# EAGLE design breakout (EAGLE 6.5.0)
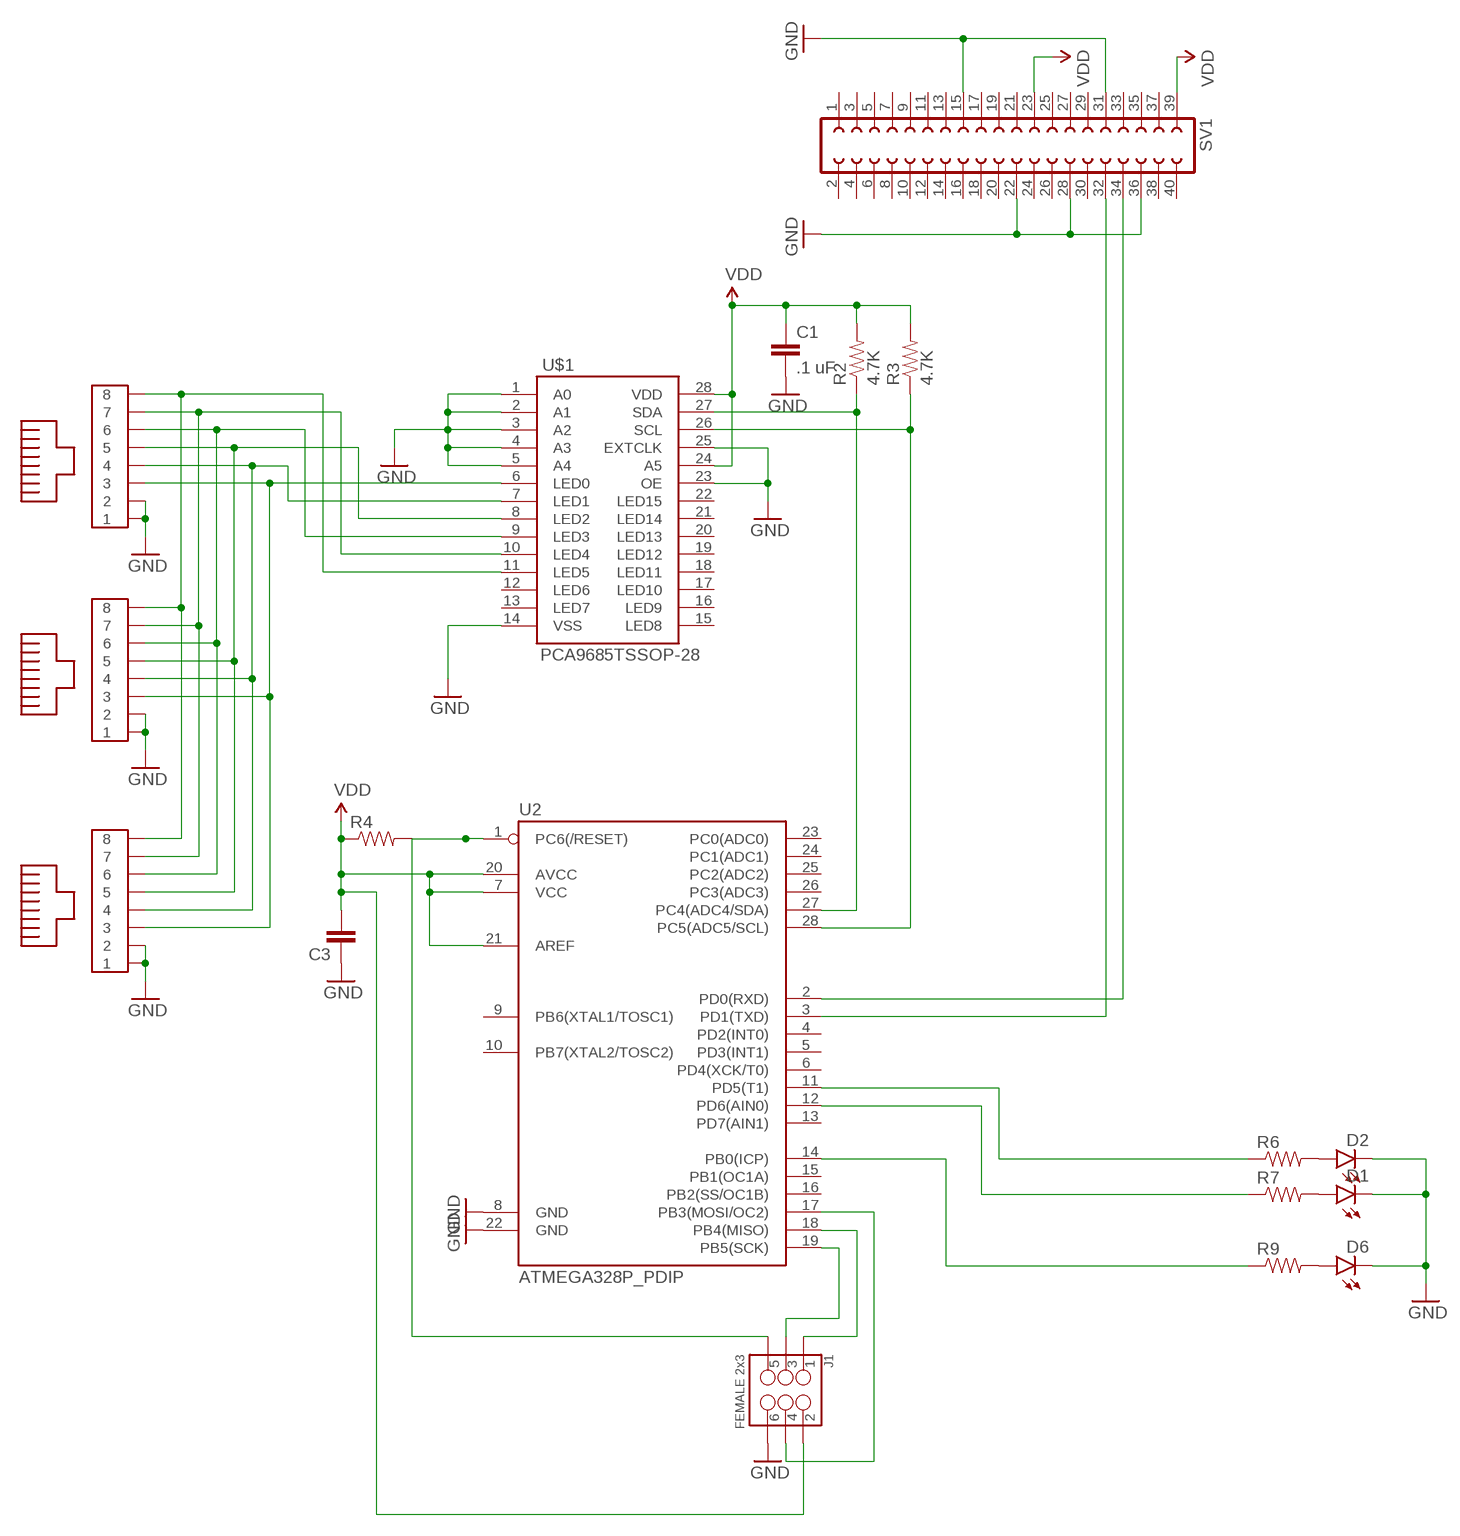
[diagram p0: schematic, sheet 1]

## Parts
C1  .1 uF  CAP1206  [1206]
C3  CAP1206  [1206]
D1  LED0603  [LED-0603]
D2  LED0603  [LED-0603]
D6  LED0603  [LED-0603]
J1  FEMALE 2x3  M03X2FEMALE  [2X3]
R2  4.7K  RESISTOR1206  [1206]
R3  4.7K  RESISTOR1206  [1206]
R4  RESISTOR1206  [1206]
R6  RESISTOR1206  [1206]
R7  RESISTOR1206  [1206]
R9  RESISTOR1206  [1206]
SV1  FE20-2  [FE20-2]
U2  ATMEGA328P_PDIP  [DIL28-3]
U$1  PCA9685TSSOP-28  [TSSOP28]
U$2  MOLEX-RJ45-SMT  [MOLEX-RJ45-SMT]
U$3  MOLEX-RJ45-SMT  [MOLEX-RJ45-SMT]
U$4  MOLEX-RJ45-SMT  [MOLEX-RJ45-SMT]

## Nets
GND: C1.2 C3.1 D1.C D2.C D6.C J1.6 SV1.15 SV1.22 SV1.28 SV1.31 SV1.36 U2.8(GND) U2.22(GND) U$1.1(A0) U$1.2(A1) U$1.3(A2) U$1.4(A3) U$1.5(A4) U$1.14(VSS) U$1.23(OE) U$1.25(EXTCLK) U$2.1 U$2.2 U$3.1 U$3.2 U$4.1 U$4.2
N$1: SV1.32 U2.3(PD1(TXD))
N$2: J1.5 R4.2 U2.1(PC6(/RESET))
N$3: U$1.6(LED0) U$2.3 U$3.3 U$4.3
N$4: R2.1 U2.27(PC4(ADC4/SDA)) U$1.27(SDA)
N$7: D2.A R6.2
N$8: J1.4 U2.17(PB3(MOSI/OC2))
N$10: SV1.34 U2.2(PD0(RXD))
N$11: U$1.7(LED1) U$2.4 U$3.4 U$4.4
N$12: U$1.11(LED5) U$2.8 U$3.8 U$4.8
N$13: U$1.10(LED4) U$2.7 U$3.7 U$4.7
N$14: U$1.9(LED3) U$2.6 U$3.6 U$4.6
N$15: U$1.8(LED2) U$2.5 U$3.5 U$4.5
N$16: J1.1 U2.18(PB4(MISO))
N$17: J1.3 U2.19(PB5(SCK))
N$18: D1.A R7.2
N$20: D6.A R9.2
N$21: R9.1 U2.14(PB0(ICP))
N$23: R7.1 U2.12(PD6(AIN0))
N$24: R6.1 U2.11(PD5(T1))
N$25: R3.1 U2.28(PC5(ADC5/SCL)) U$1.26(SCL)
VDD: C1.1 C3.2 J1.2 R2.2 R3.2 R4.1 SV1.23 SV1.39 U2.7(VCC) U2.20(AVCC) U2.21(AREF) U$1.24(A5) U$1.28(VDD)
Unconnected: SV1.1 SV1.2 SV1.3 SV1.4 SV1.5 SV1.6 SV1.7 SV1.8 SV1.9 SV1.10 SV1.11 SV1.12 SV1.13 SV1.14 SV1.16 SV1.17 SV1.18 SV1.19 SV1.20 SV1.21 SV1.24 SV1.25 SV1.26 SV1.27 SV1.29 SV1.30 SV1.33 SV1.35 SV1.37 SV1.38 SV1.40 U2.4(PD2(INT0)) U2.5(PD3(INT1)) U2.6(PD4(XCK/T0)) U2.9(PB6(XTAL1/TOSC1)) U2.10(PB7(XTAL2/TOSC2)) U2.13(PD7(AIN1)) U2.15(PB1(OC1A)) U2.16(PB2(SS/OC1B)) U2.23(PC0(ADC0)) U2.24(PC1(ADC1)) U2.25(PC2(ADC2)) U2.26(PC3(ADC3)) U$1.12(LED6) U$1.13(LED7) U$1.15(LED8) U$1.16(LED9) U$1.17(LED10) U$1.18(LED11) U$1.19(LED12) U$1.20(LED13) U$1.21(LED14) U$1.22(LED15)

## Library data of the parts
C1 C3 = SparkFun-Capacitors:CAP: Capacitor Standard 0603 ceramic capacitor, and 0.1" leaded capacitor.
D1 D2 D6 = SparkFun-LED:LED: LEDs Standard schematic elements and footprints for 5mm, 3mm, 1206, and 0603 sized LEDs. 5mm - Spark Fun Electronics SKU : COM-00529 (and others)
J1 = SparkFun-Connectors:M03X2: 2x3 .1" header. Shrouded, with keying- CONN-10681 SMT- CONN-11415 Pogo pins- HW-11044; PROD_ID: CONN-11566
R2-R4 R6 R7 R9 = SparkFun-Resistors:RESISTOR: Resistor Basic schematic elements and footprints for 0603, 1206, and PTH resistors.
SV1 = con-lsta:FE20-2: FEMALE HEADER; OC_FARNELL: unknown; OC_NEWARK: unknown
U2 = SparkFun-DigitalIC:ATMEGA328P_PDIP: uC used in the Arduino 32kb flash, 1k EEPROM, 2k SRAM This is the through-hole version of this chip.
U$1 = MyLibrary:PCA9685
U$2-U$4 = SMD-RJ45:MOLEX-RJ45-SMT

## Board
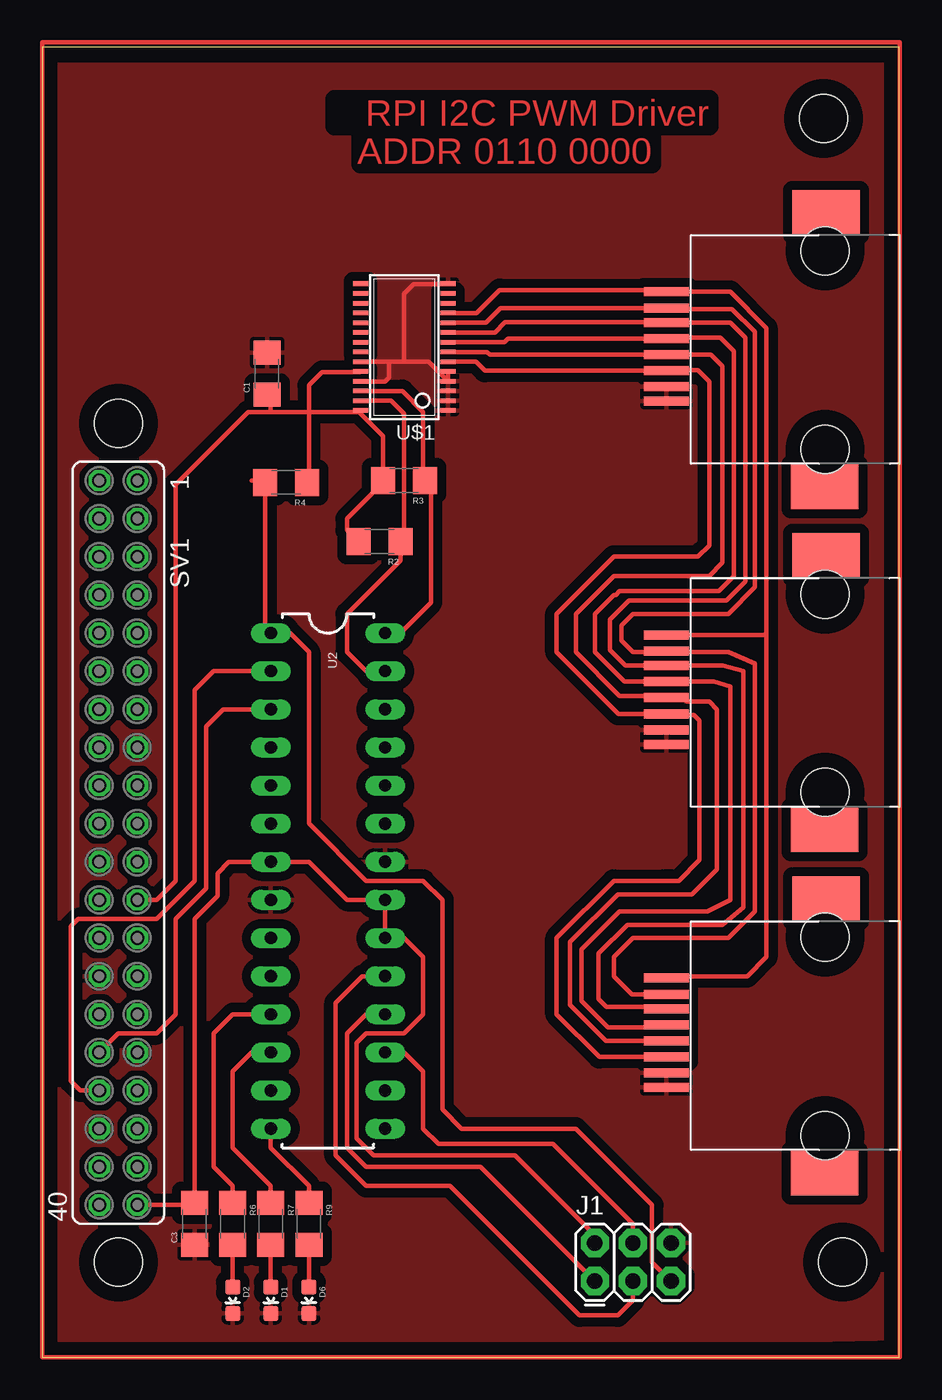
[diagram p1: board, top side]
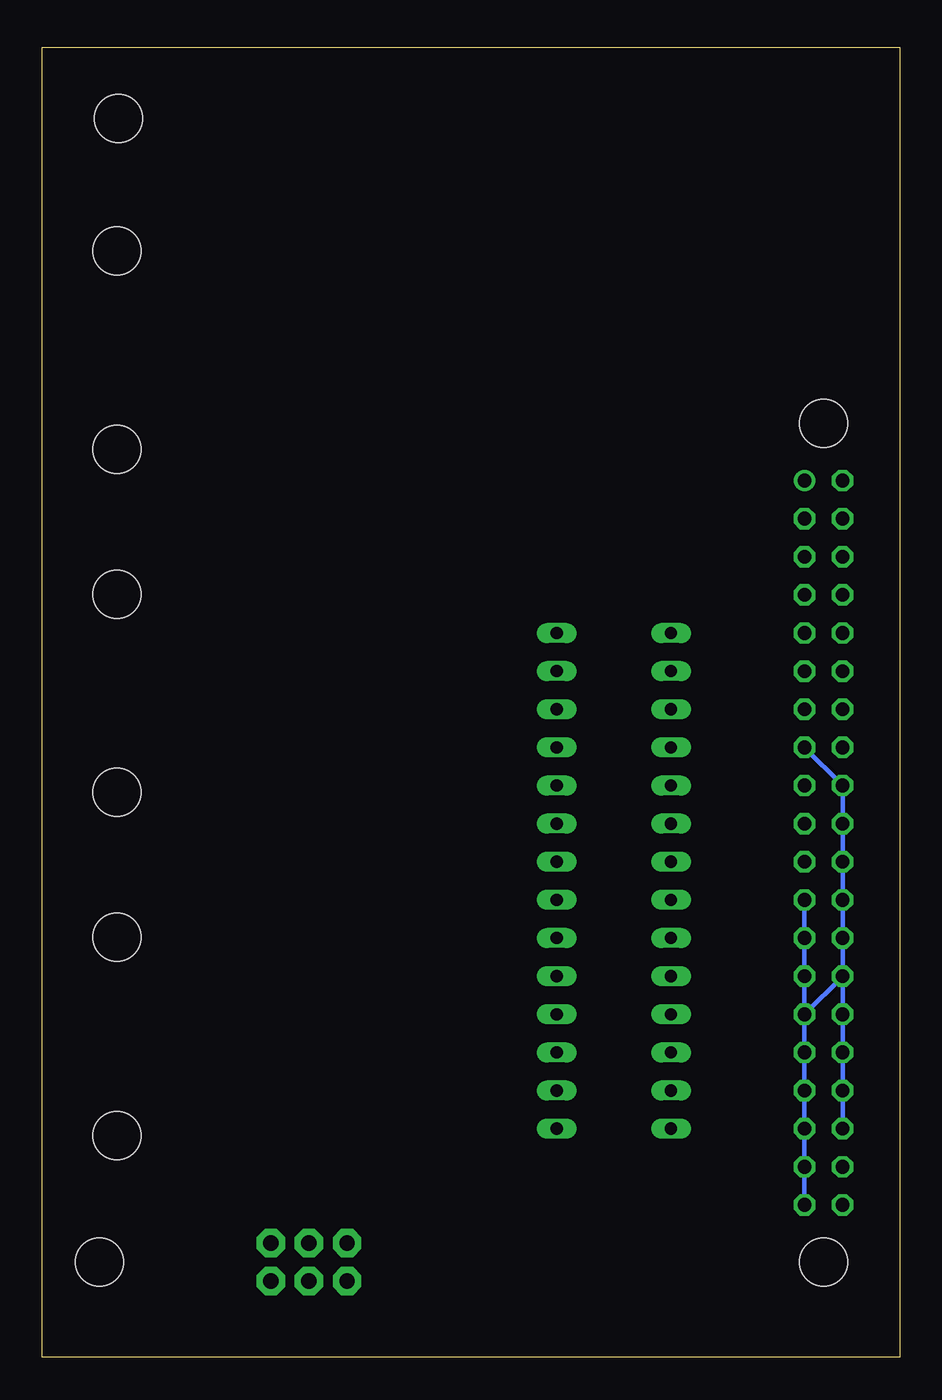
[diagram p2: board, bottom side, seen from below]

Size 57.13 x 87.3 mm. Coordinates in mm from the lower left corner, seen from the top.
Outline: 0,0 57.13,0 57.13,87.3 0,87.3 0,0
Copper layers (1*16): Top 0.035mm / dielectric 1.5mm / Bottom 0.035mm
Design rules "default": minimum track width 10mil, minimum drill 24mil, track to track 8mil, track to pad 8mil, pad to pad 8mil, via to via 8mil, smd to smd 8mil, copper to edge 40mil, drill to drill 8mil, minimum pad ring 10mil, minimum via ring 8mil, stop-mask expansion 4mil, vias tented up to drill 0mil, thermal gap 10mil
Holes 3.2 mm at 52.07,82.55 5.08,6.35 53.34,6.35 5.08,62.23

### Footprints (pad centres in the part's own frame; a part is rotated, then mirrored left to right if it is on the bottom)
1206 = smd 1.6 x 1.8: 1 -1.4,0; 2 1.4,0
LED-0603 = smd 1 x 1: A 0,-0.877; C 0,0.877
2X3 = drill 1.016 pad 1.88 octagon: 1 0,0; 2 0,2.54; 3 2.54,0; 4 2.54,2.54; 5 5.08,0; 6 5.08,2.54
FE20-2 = drill 0.914: 1 -24.13,1.27 | drill 0.914 octagon: 2 -24.13,-1.27; 3 -21.59,1.27; 4 -21.59,-1.27; 5 -19.05,1.27; 6 -19.05,-1.27; 7 -16.51,1.27; 8 -16.51,-1.27; 9 -13.97,1.27; 10 -13.97,-1.27; 11 -11.43,1.27; 12 -11.43,-1.27; 13 -8.89,1.27; 14 -8.89,-1.27; 15 -6.35,1.27; 16 -6.35,-1.27; 17 -3.81,1.27; 18 -3.81,-1.27; 19 -1.27,1.27; 20 -1.27,-1.27; 21 1.27,1.27; 22 1.27,-1.27; 23 3.81,1.27; 24 3.81,-1.27; 25 6.35,1.27; 26 6.35,-1.27; 27 8.89,1.27; 28 8.89,-1.27; 29 11.43,1.27; 30 11.43,-1.27; 31 13.97,1.27; 32 13.97,-1.27; 33 16.51,1.27; 34 16.51,-1.27; 35 19.05,1.27; 36 19.05,-1.27; 37 21.59,1.27; 38 21.59,-1.27; 39 24.13,1.27; 40 24.13,-1.27
DIL28-3 = drill 0.813 long: 1 -16.51,-3.81; 2 -13.97,-3.81; 3 -11.43,-3.81; 4 -8.89,-3.81; 5 -6.35,-3.81; 6 -3.81,-3.81; 7 -1.27,-3.81; 8 1.27,-3.81; 9 3.81,-3.81; 10 6.35,-3.81; 11 8.89,-3.81; 12 11.43,-3.81; 13 13.97,-3.81; 14 16.51,-3.81; 15 16.51,3.81; 16 13.97,3.81; 17 11.43,3.81; 18 8.89,3.81; 19 6.35,3.81; 20 3.81,3.81; 21 1.27,3.81; 22 -1.27,3.81; 23 -3.81,3.81; 24 -6.35,3.81; 25 -8.89,3.81; 26 -11.43,3.81; 27 -13.97,3.81; 28 -16.51,3.81
TSSOP28 = smd 0.305 x 0.991: 1 -4.225,-2.918; 2 -3.575,-2.918; 3 -2.925,-2.918; 4 -2.275,-2.918; 5 -1.625,-2.918; 6 -0.975,-2.918; 7 -0.325,-2.918; 8 0.325,-2.918; 9 0.975,-2.918; 10 1.625,-2.918; 11 2.275,-2.918; 12 2.925,-2.918; 13 3.575,-2.918; 14 4.225,-2.918; 15 4.225,2.918; 16 3.575,2.918; 17 2.925,2.918; 18 2.275,2.918; 19 1.625,2.918; 20 0.975,2.918; 21 0.325,2.918; 22 -0.325,2.918; 23 -0.975,2.918; 24 -1.625,2.918; 25 -2.275,2.918; 26 -2.925,2.918; 27 -3.575,2.918; 28 -4.225,2.918
MOLEX-RJ45-SMT = smd 3 x 0.6: 1 10.48,3.61; 2 10.48,2.64; 3 10.48,1.57; 4 10.48,0.5; 5 10.48,-0.57; 6 10.48,-1.64; 7 10.48,-2.61; 8 10.48,-3.68 | smd 4.5 x 3: P$1 -0.16,-8.97; P$2 -0.06,9.28 | hole 3.2: -0.1,6.8; -0.1,-6.4

### Placement (x,y rotation side)
C1  14.99,65.53 90 top
C3  10.16,8.89 90 top
D1  15.24,3.81 180 top
D2  12.7,3.81 180 top
D6  17.78,3.81 180 top
J1  36.83,5.08 0 top
R2  22.48,54.36 180 top
R3  24.13,58.42 180 top
R4  16.26,58.29 180 top
R6  12.7,8.89 270 top
R7  15.24,8.89 270 top
R9  17.78,8.89 270 top
SV1  5.08,34.29 270 top
U2  19.05,31.75 270 top
U$1  24.13,67.31 90 top
U$2  52.07,67.31 180 top
U$3  52.07,21.59 180 top
U$4  52.07,44.45 180 top

### Tracks (layer width: path | path; a pad name or v marks a point on that pad's centre or on a via)
GND
  Top 0.254: 41.91,40.64 U$4.1 41.91,40.64
  Top 0.305: U$1.4 | U$1.4 U$1.5 | U$1.4 25.75,66.34 24.13,66.34 | 24.13,66.34 23.11,66.34 | 23.11,66.34 U$1.23 | U$1.25 21.22,65.02 22.86,65.02 23.11,65.28 23.11,66.34 | U$1.14 27.01,71.5 24.77,71.5 24.13,70.87 24.13,66.34
  Bottom 0.305: SV1.36 SV1.28 | SV1.28 SV1.22 3.81,38.1 SV1.15 | SV1.28 6.35,22.86 SV1.31
  pour Top (isolate 0.61): 0,86.36 57.15,87.63 57.15,1.27 0,0
N$1
  Top 0.305: SV1.32 5.08,21.59 7.62,21.59 8.89,22.86 8.89,29.21 10.92,31.24 10.92,34.8 10.92,35.18 10.92,42.04 12.06,43.18 U2.3
N$2
  Top 0.305: 13.97,58.42 14.73,58.42 R4.2 14.86,48.64 U2.1 16.51,48.26 17.78,46.99 17.78,35.56 21.59,31.75 25.4,31.75 26.67,30.48 26.67,16.51 27.94,15.24 35.56,15.24 40.64,10.16 40.64,6.35 J1.5
N$3
  Top 0.305: U$3.3 37.13,20.02 34.29,22.86 34.29,27.94 38.1,31.75 41.4,31.75 41.91,31.75 42.42,31.75 43.82,33.15 43.82,42.42 43.43,42.8 41.67,42.8 U$4.3 38.4,42.88 34.29,46.99 34.29,49.53 38.1,53.34 43.69,53.34 44.45,54.1 44.45,65.02 43.69,65.79 41.64,65.79 U$2.3 29.51,65.74 28.91,66.34 U$1.6
N$4
  Top 0.305: U$1.27 21.23,63.75 23.24,63.75 24.13,62.87 24.13,54.61 R2.1 23.88,53.09 20.32,49.53 20.32,46.99 21.59,45.72 U2.27
N$7
  Top 0.305: D2.A R6.2
N$8
  Top 0.305: U2.17 24.13,20.32 25.4,19.05 25.4,15.24 26.42,14.22 34.04,14.22 39.37,8.89 J1.4
N$9
  Top 0.305: 0,87.63 57.15,87.63 57.15,0 0,0 0,87.63
N$10
  Top 0.305: SV1.34 2.54,17.78 1.91,18.41 1.91,28.7 2.41,29.21 7.62,29.21 10.16,31.75 10.16,44.45 11.43,45.72 U2.2
N$11
  Top 0.305: U$3.4 37.58,21.09 35.18,23.49 35.18,27.69 38.35,30.86 43.31,30.86 44.96,32.51 44.96,43.18 44.45,43.69 42.93,43.69 42.55,44.07 41.71,44.07 | 41.71,44.07 U$4.4 | 41.71,44.07 38.48,44.07 35.56,46.99 35.56,49.53 38.1,52.07 44.45,52.07 45.34,52.96 45.34,66.04 44.58,66.8 U$2.4 29.84,66.8 29.66,66.98 U$1.7
N$12
  Top 0.305: 48.26,48.26 48.26,68.58 45.85,70.99 U$2.8 41.46,71.12 30.48,71.12 28.95,69.59 U$1.11 | 48.26,48.26 48.26,26.67 46.99,25.4 41.72,25.4 U$3.8 | U$4.8 48.13,48.13 48.26,48.26
N$13
  Top 0.254: 43.18,69.85 41.91,69.85 U$2.7 | 43.18,46.99 41.91,46.99 U$4.7
  Top 0.305: U$3.7 39.3,24.2 38.1,25.4 38.1,26.67 39.37,27.94 45.72,27.94 47.5,29.72 47.5,46.23 45.72,46.99 41.66,46.99 U$4.7 41.52,46.99 39.37,46.99 38.61,47.75 38.61,48.77 39.37,49.53 45.72,49.53 47.5,51.31 47.5,68.33 45.97,69.85 41.91,69.85 | U$1.10 29.57,68.94 30.55,69.92 U$2.7
N$14
  Top 0.305: 41.45,46.23 U$4.6 | U$4.6 45.35,46.09 46.74,45.72 46.74,29.97 45.34,28.83 38.99,28.83 37.08,26.92 37.08,23.88 37.59,23.37 41.45,23.37 U$3.6 | U$4.6 41.58,46.1 38.86,46.1 37.85,47.12 37.85,49.15 39.12,50.42 45.59,50.42 46.86,51.69 46.86,67.95 45.86,68.95 U$2.6 41.58,68.96 30.86,68.96 30.18,68.29 U$1.9
N$15
  Top 0.305: U$3.5 41.4,21.97 37.72,21.97 35.94,23.75 35.94,27.18 38.48,29.72 44.32,29.72 45.85,30.48 45.85,44.7 44.77,45.02 U$4.5 38.8,45.02 36.83,46.99 36.83,49.53 38.1,50.8 38.23,50.8 38.48,51.05 45.09,51.05 46.1,52.07 46.1,67.06 45.21,67.95 41.66,67.95 U$2.5 31.05,67.88 30.8,67.64 U$1.8
N$16
  Top 0.305: U2.18 21.59,22.86 20.32,21.59 20.32,13.97 21.59,12.7 29.21,12.7 J1.1
N$17
  Top 0.305: U2.19 21.34,25.4 19.56,23.62 19.56,13.46 21.59,11.43 27.18,11.43 35.81,2.79 38.35,2.79 39.37,3.81 J1.3
N$18
  Top 0.305: D1.A R7.2
N$20
  Top 0.305: D6.A R9.2
N$21
  Top 0.305: U2.14 15.24,13.97 17.78,11.43 R9.1
N$23
  Top 0.305: U2.12 13.97,20.32 12.7,19.05 12.7,13.97 15.24,11.43 R7.1
N$24
  Top 0.305: U2.11 12.7,22.86 11.43,21.59 11.43,12.7 12.7,11.43 R6.1
N$25
  Top 0.305: U$1.26 24,64.39 25.4,62.99 25.4,58.55 R3.1 25.91,58.04 25.91,50.29 23.88,48.26 U2.28
VDD
  Top 0.305: U$1.28 21.12,62.99 | 21.12,62.99 17.78,62.99 | 17.78,62.99 15.24,62.99 | 15.24,62.99 13.72,62.99 8.89,58.17 8.89,31.75 7.62,30.48 SV1.23 | U$1.24 21.19,65.66 18.67,65.66 17.78,64.77 17.78,62.99 | C1.1 15.24,63.88 15.24,62.99 | 21.12,62.99 22.73,61.38 R3.2 22.73,58.29 20.32,55.88 20.32,55.12 R2.2 | SV1.39 10.03,10.16 C3.2 10.16,29.21 11.68,30.73 11.68,32.26 12.45,33.02 U2.7 17.78,33.02 20.32,30.48 U2.21 U2.20 24.13,27.94 25.4,26.67 25.4,22.86 24.13,21.59 21.59,21.59 20.95,20.95 20.95,14.61 22.1,13.46 31.5,13.46 36.83,8.13 J1.2 | R4.1 17.78,58.29 17.78,62.99
  Bottom 0.305: SV1.23 SV1.39

### Text on the board
Top: RPI I2C PWM Driver | ADDR 0110 0000